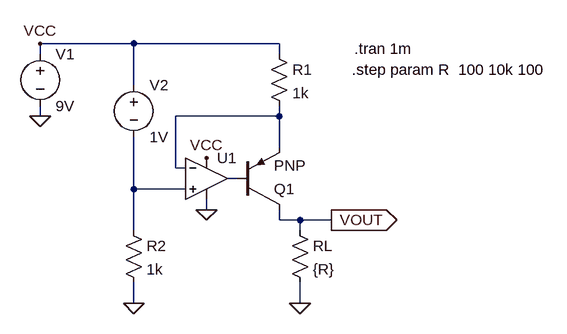
[diagram p0: schematic constant current.asc]
constant current.asc, the LTspice schematic file:
Version 4
SHEET 1 880 680
WIRE 128 -32 -16 -32
WIRE 352 -32 128 -32
WIRE -16 -16 -16 -32
WIRE 352 -16 352 -32
WIRE 128 32 128 -32
WIRE -16 80 -16 64
WIRE 352 80 352 64
WIRE 352 80 192 80
WIRE 352 128 352 80
WIRE 192 160 192 80
WIRE 208 160 192 160
WIRE 288 176 272 176
WIRE 128 192 128 112
WIRE 208 192 128 192
WIRE 240 224 240 208
WIRE 352 240 352 224
WIRE 384 240 352 240
WIRE 432 240 384 240
WIRE 128 256 128 192
WIRE 384 256 384 240
WIRE 128 368 128 336
WIRE 384 368 384 336
FLAG 240 144 VCC
FLAG 128 368 0
FLAG 384 368 0
FLAG -16 -32 VCC
FLAG 240 224 0
FLAG -16 80 0
FLAG 432 240 VOUT
IOPIN 432 240 Out
SYMBOL Opamps\\UniversalOpamp2 240 176 R0
SYMATTR InstName U1
SYMBOL res 112 240 R0
SYMATTR InstName R2
SYMATTR Value 1k
SYMBOL pnp 288 224 M180
SYMATTR InstName Q1
SYMBOL res 336 -32 R0
SYMATTR InstName R1
SYMATTR Value 1k
SYMBOL res 368 240 R0
SYMATTR InstName RL
SYMATTR Value {R}
SYMBOL voltage -16 -32 R0
SYMATTR InstName V1
SYMATTR Value 9V
SYMBOL voltage 128 16 R0
SYMATTR InstName V2
SYMATTR Value 1V
TEXT 468 -24 Left 2 !.tran 1m
TEXT 464 8 Left 2 !.step param R  100 10k 100

The netlist it stands for:
* constant current.asc
XU1 N003 N001 VCC 0 N002 level.2 Avol=1Meg GBW=10Meg Slew=10Meg ilimit=25m rail=0 Vos=0 phimargin=45 en=0 enk=0 in=0 ink=0 Rin=500Meg  ; pins IN+ IN- V+ V- OUT
R2 N003 0 1k
Q1 VOUT N002 N001 0 PNP
R1 VCC N001 1k
RL VOUT 0 {R}
V1 VCC 0 9V
V2 VCC N003 1V
.model NPN NPN
.model PNP PNP
.lib standard.bjt
.tran 1m
.step param R  100 10k 100
.lib UniversalOpamps2.sub
.backanno
.end